# Altium schematic sheet ft600_AD.SchDoc
size A3
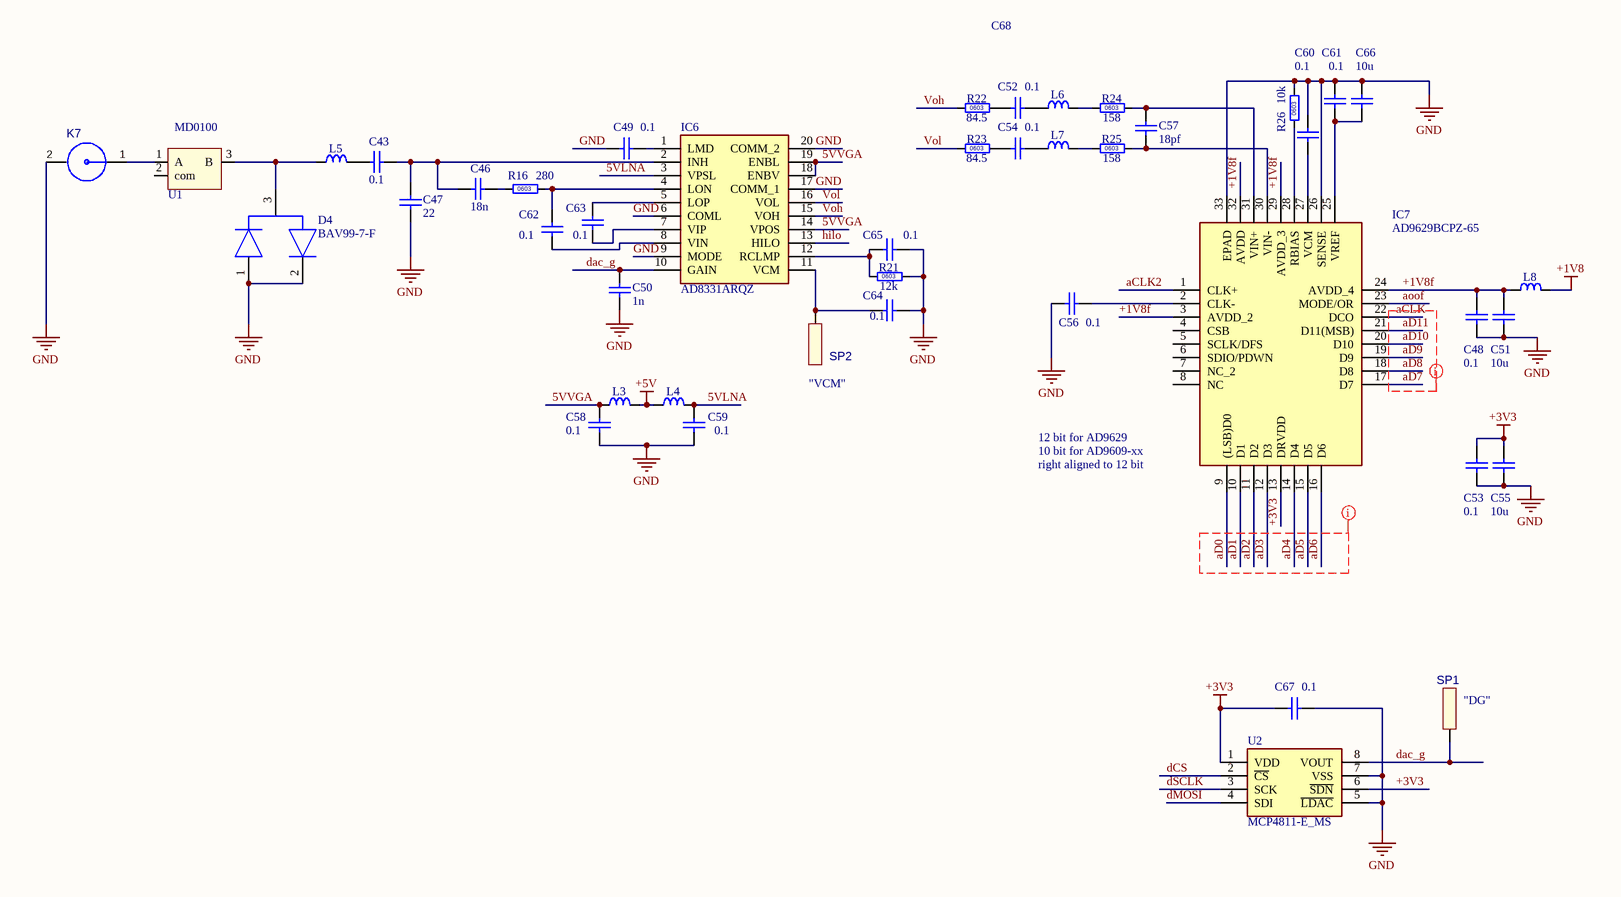
[diagram p0: ft600_AD.SchDoc]

## Parts
C43  value 0.1  [SM0603 _3D_cap]  (hidden comment: cap0603)
C46  value 18n  [SM0603 _3D_cap]  (hidden comment: cap0603)
C47  value 22  [SM0603 _3D_cap]  (hidden comment: cap0603)
C48  value 0.1  [SM0603 _3D_cap]  (hidden comment: cap0603)
C49  value 0.1  [SM0603 _3D_cap]  (hidden comment: cap0603)
C50  value 1n  [SM0603 _3D_cap]  (hidden comment: cap0603)
C51  value 10u  [SM0603 _3D_cap]  (hidden comment: cap0603)
C52  value 0.1  [SM0603 _3D_cap]  (hidden comment: cap0603)
C53  value 0.1  [SM0603 _3D_cap]  (hidden comment: cap0603)
C54  value 0.1  [SM0603 _3D_cap]  (hidden comment: cap0603)
C55  value 10u  [SM0603 _3D_cap]  (hidden comment: cap0603)
C56  value 0.1  [SM0603 _3D_cap]  (hidden comment: cap0603)
C57  value 18pf  [SM0603 _3D_cap]  (hidden comment: cap0603)
C58  value 0.1  [SM0603 _3D_cap]  (hidden comment: cap0603)
C59  value 0.1  [SM0603 _3D_cap]  (hidden comment: cap0603)
C60  value 0.1  [SM0603 _3D_cap]  (hidden comment: cap0603)
C61  value 0.1  [SM0603 _3D_cap]  (hidden comment: cap0603)
C62  value 0.1  [SM0603 _3D_cap]  (hidden comment: cap0603)
C63  value 0.1  [SM0603 _3D_cap]  (hidden comment: cap0603)
C64  value 0.1  [SM0603 _3D_cap]  (hidden comment: cap0603)
C65  value 0.1  [SM0603 _3D_cap]  (hidden comment: cap0603)
C66  value 10u  [SM0603 _3D_cap]  (hidden comment: cap0603)
C67  value 0.1  [SM0603 _3D_cap]  (hidden comment: cap0603)
D4  BAV99-7-F  [SOT95P240X120-3N]
IC6  AD8331ARQZ  [SOP64P600X175-20N]
IC7  AD9629BCPZ-65  [QFN50P500X500X100-33N]
K7  SMA_Edge  [AMPHENOL_132357-11]  (value not drawn)
L3  75R@100MHz  [SM0603_3D_res]  (value not drawn)
L4  75R@100MHz  [SM0603_3D_res]  (value not drawn)
L5  75R@100MHz  [SM0603_3D_res]  (value not drawn)
L6  75R@100MHz  [SM_0805_INDUCTANCE _3D]  (value not drawn)
L7  75R@100MHz  [SM_0805_INDUCTANCE _3D]  (value not drawn)
L8  75R@100MHz  [SM0603_3D_res]  (value not drawn)
R16  280  [SM0603_3D_res]
R21  12k  [SM0603_3D_res]
R22  84.5  [SM0603_3D_res]
R23  84.5  [SM0603_3D_res]
R24  158  [SM0603_3D_res]
R25  158  [SM0603_3D_res]
R26  10k  [SM0603_3D_res]
SP1  value "DG"  [SolderPad_D1mm _round]  (hidden comment: SolderPad D1mm_round)
SP2  value "VCM"  [SolderPad_D1mm _round]  (hidden comment: SolderPad D1mm_round)
U1  T/R switch  [SOT89-150P409X160-3N]  (value not drawn)
U2  MCP4811-E_MS  [SOP65P490X110-8N]

## Nets
+1V8: L8.2
+3V3: C53.1 C55.1 C67.2 IC7.13(DRVDD) U2.1(VDD) U2.6(~{SDN})
+5V: L3.2 L4.1
GND: C47.1 C48.2 C49.1 C50.1 C51.2 C53.2 C55.2 C56.2 C58.1 C59.1 C60.1 C61.1 C64.1 C65.1 C66.1 C67.1 D4.1(ANODE) D4.2(CATHODE) IC6.6(COML) IC6.9(MODE) IC6.17(COMM_1) IC6.20(COMM_2) IC7.26(SENSE) IC7.33(EPAD) K7.2 R21.2 R26.2 U2.5(~{LDAC}) U2.7(VSS)
5VLNA: C59.2 IC6.3(VPSL) L4.2
5VVGA: C58.2 IC6.14(VPOS) IC6.18(ENBV) IC6.19(ENBL) L3.1
+1V8f: C48.1 C51.1 IC7.3(AVDD_2) IC7.24(AVDD_4) IC7.29(AVDD_3) IC7.32(AVDD) L8.1
aCLK: IC7.22(DCO)
aCLK2: IC7.1(CLK+)
aD0: IC7.9((LSB)D0)
aD1: IC7.10(D1)
aD2: IC7.11(D2)
aD3: IC7.12(D3)
aD4: IC7.14(D4)
aD5: IC7.15(D5)
aD6: IC7.16(D6)
aD7: IC7.17(D7)
aD8: IC7.18(D8)
aD9: IC7.19(D9)
aD10: IC7.20(D10)
aD11: IC7.21(D11(MSB))
aoof: IC7.23(MODE/OR)
dac_g: C50.2 IC6.10(GAIN) SP1.1 U2.8(VOUT)
dCS: U2.2(~{CS})
dMOSI: U2.4(SDI)
dSCLK: U2.3(SCK)
hilo: IC6.13(HILO)
Voh: IC6.15(VOH) R22.1
Vol: IC6.16(VOL) R23.1
NetC43_1: C43.1 L5.2
NetC43_2: C43.2 C46.2 C47.2 IC6.2(INH)
NetC46_1: C46.1 R16.1
NetC49_2: C49.2 IC6.1(LMD)
NetC52_1: C52.1 L6.1
NetC52_2: C52.2 R22.2
NetC54_1: C54.1 L7.1
NetC54_2: C54.2 R23.2
NetC56_1: C56.1 IC7.2(CLK-)
NetC57_1: C57.1 IC7.31(VIN+) R24.2
NetC57_2: C57.2 IC7.30(VIN-) R25.2
NetC60_2: C60.2 IC7.27(VCM)
NetC61_2: C61.2 C66.2 IC7.25(VREF)
NetC62_1: C62.1 IC6.8(VIN)
NetC62_2: C62.2 IC6.4(LON) R16.2
NetC63_1: C63.1 IC6.7(VIP)
NetC63_2: C63.2 IC6.5(LOP)
NetC64_2: C64.2 IC6.11(VCM) SP2.1
NetC65_2: C65.2 IC6.12(RCLMP) R21.1
NetD4_3: D4.3(A/K) L5.1 U1.3(B)
NetIC7_28: IC7.28(RBIAS) R26.1
NetK7_1: K7.1 U1.1(A)
NetL6_2: L6.2 R24.1
NetL7_2: L7.2 R25.1

Not connected (* = marked no-connect by the designer): IC7 4(CSB) 5(SCLK/DFS) 6(SDIO/PDWN) 7(NC_2) 8(NC); U1 2(com)

## Layout directives
net class data; rule Matched Net Lengths [Tolerance = 20mil]: aCLK, aD0, aD1, aD2, aD3, aD4, aD5, aD6, aD7, aD8, aD9, aD10, aD11

## Notes on the sheet
- C68
- (near U1) MD0100
- 12 bit for AD9629
- (near IC7) 10 bit for AD9609-xx
- (near IC7) right aligned to 12 bit
- (in symbol Res_0603_EU) 0603

## Library data of the parts
C43 C46-C67 = cap0603: Capacitor  0603 inch; Published: 8-Jun-2000; LatestRevisionDate: 17-Jul-2002; LatestRevisionNote: Re-released for DXP Platform.; PackageReference: RAD-0.3; Publisher: Altium Limited; PackageDescription: Radial Cap, Thru-Hole; 2 Leads; 0.3 in Pin Spacing
D4 = BAV99-7-F: Diode; Manufacturer_Name: Diodes Inc.; Datasheet Link: https://www.diodes.com/assets/Datasheets/ds12007.pdf; Height: 1.2mm; Manufacturer_Part_Number: BAV99-7-F; Mouser Part Number: 621-BAV99-F; Mouser Price/Stock: https://www.mouser.co.uk/ProductDetail/Diodes-Incorporated/BAV99-7-F?qs=E9Ihi8A05%252BSTVRjo74hQDA%3D%3D; Arrow Part Number: BAV99-7-F; Arrow Price/Stock: https://www.arrow.com/en/products/bav99-7-f/diodes-incorporated?region=nac
IC6 = AD8331ARQZ: Integrated Circuit; Manufacturer_Name: Analog Devices; Datasheet Link: http://www.analog.com/static/imported-files/data_sheets/AD8331_8332_8334.pdf; Height: 1.75mm; Manufacturer_Part_Number: AD8331ARQZ; Mouser Part Number: 584-AD8331ARQZ; Mouser Price/Stock: https://www.mouser.co.uk/ProductDetail/Analog-Devices/AD8331ARQZ?qs=%2FtpEQrCGXCwx0%2F22gf7ohQ%3D%3D; Arrow Part Number: AD8331ARQZ; Arrow Price/Stock: https://www.arrow.com/en/products/ad8331arqz/analog-devices
IC7 = AD9629BCPZ-65: Integrated Circuit; Manufacturer_Name: Analog Devices; Manufacturer_Part_Number: AD9629BCPZ-65; Mouser Part Number: 584-AD9629BCPZ-65; Mouser Price/Stock: https://www.mouser.co.uk/ProductDetail/Analog-Devices/AD9629BCPZ-65?qs=BpaRKvA4VqGjvk9AFyB3jg%3D%3D; Arrow Part Number: AD9629BCPZ-65; Arrow Price/Stock: https://www.arrow.com/en/products/ad9629bcpz-65/analog-devices
L3-L5 L8 = chip inductance 0603: Part Number: IND0805_MURATA_BLM21BB750SN1D; Part Description: SMD EMIFIL Suppression Chip Ferrite Bead; Manufacturer: MURATA; Manufacturer Part Number: BLM21BB750SN1D; Power: 700mA; Resistance: 0.16R; Tolerance: ±25%; Table: Inductors SMD; Component Kind: Standard; Component Type: Standard; Footprint: INDC2012X105N; Pin Count: 2; Value: 75R@100MHz; Status: None; Case: 0805; Mounted: Yes; Socket: No; SMD: Yes; ComponentHeight: 1.05mm; Author: S. Jafar; CreateDate: 12/21/2015; LatestRevisionDate: 12/21/2015
L6 L7 = Ind_Chip_0805: chip inductance; Part Number: IND0805_MURATA_BLM21BB750SN1D; Part Description: SMD EMIFIL Suppression Chip Ferrite Bead; Manufacturer: MURATA; Manufacturer Part Number: BLM21BB750SN1D; Power: 700mA; Resistance: 0.16R; Tolerance: ±25%; Table: Inductors SMD; Component Kind: Standard; Component Type: Standard; Footprint: INDC2012X105N; Pin Count: 2; Value: 75R@100MHz; Status: None; Case: 0805; Mounted: Yes; Socket: No; SMD: Yes; ComponentHeight: 1.05mm; Author: S. Jafar; CreateDate: 12/21/2015; LatestRevisionDate: 12/21/2015
R16 R21-R26 = Res_0603_EU: Part Number: R1206_4K7_1%_0.25W_100PPM; Part Description: General Purpose Thick Film Chip Resistor; Manufacturer: GENERIC; Manufacturer1 Part Number: NRC12F4701TRF; Value: 4k7; Power: 0.25W; TC: ±100ppm/°C; Tolerance: ±1%; Table: Resistors SMD; Component Kind: Standard; Component Type: Standard; Footprint: RESC3216X65N; Pin Count: 2; Status: Preferred; Manufacturer Part Number: R1206_4K7_1%_0.25W_100PPM; Case: 1206; Mounted: Yes; Socket: No; SMD: Yes; Manufacturer1 Example: NIC COMPONENT; Manufacturer1 ComponentHeight: 0.65mm; HelpURL: \\cern.ch\dfs\Applications\Altium\Datasheets\R1206_NIC_NRC.pdf; Author: CERN DEM JLC; CreateDate: 12/3/2007; LatestRevisionDate: 3/13/2008
SP1 SP2 = SolderPad D1mm_round: for finger touch
U1 = MD0100N8-G
U2 = MCP4811-E_MS: Integrated Circuit; Manufacturer_Name: Microchip; Manufacturer_Part_Number: MCP4812-E/MS; Datasheet Link: http://ww1.microchip.com/downloads/en/DeviceDoc/20002249B.pdf; Height: 1.1mm; Mouser Part Number: 579-MCP4812-E/MS; Mouser Price/Stock: https://www.mouser.com/Search/Refine.aspx?Keyword=579-MCP4812-E%2FMS; Arrow Part Number: MCP4812-E/MS; Arrow Price/Stock: https://www.arrow.com/en/products/mcp4812-ems/microchip-technology
K7 = SMA_Edge: Value: *